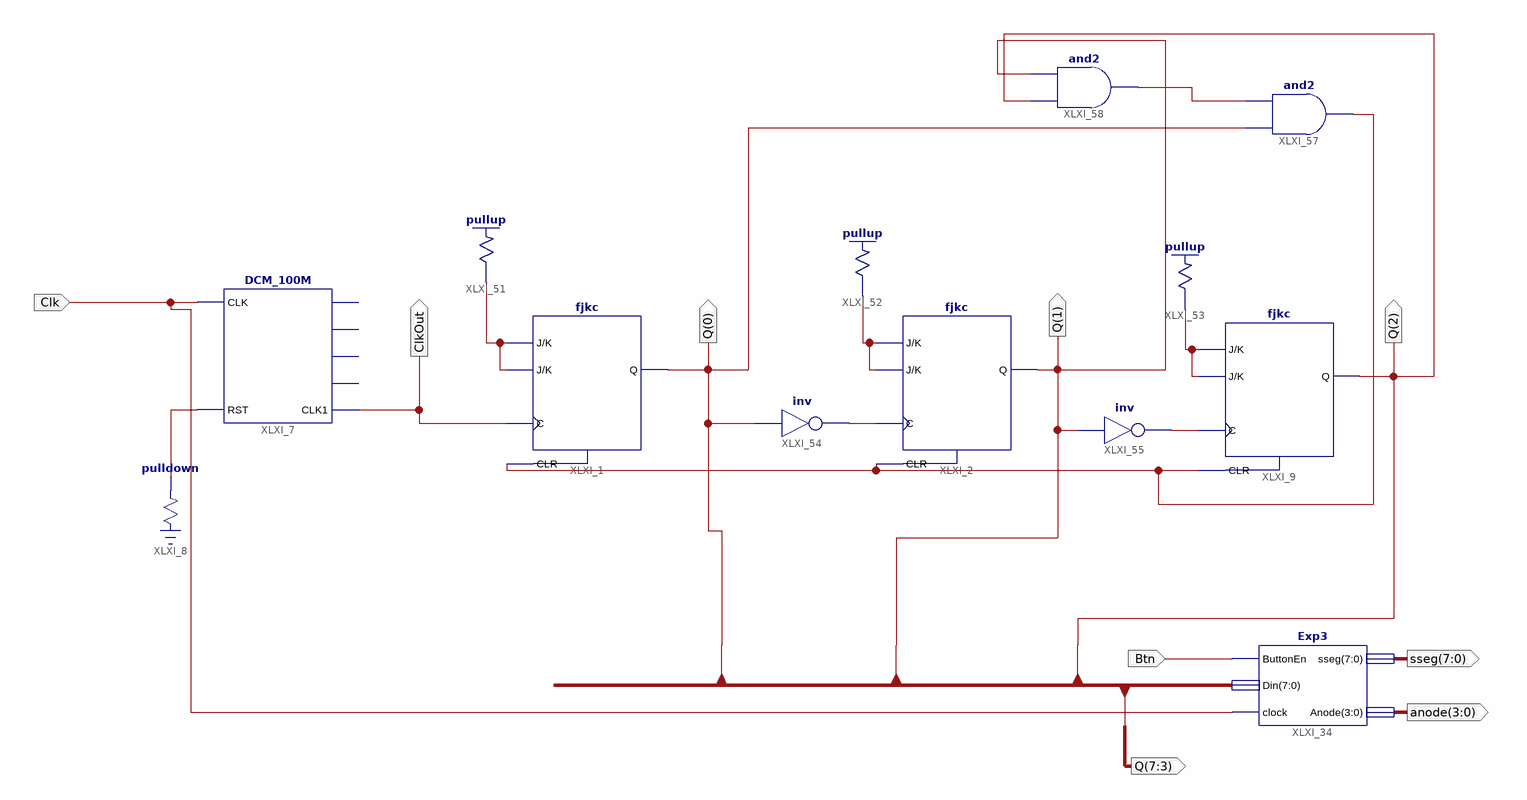
[diagram p0: schematic sheet 1]
// Xilinx ISE schematic Exp3ModCounter.sch (spartan3e) as structural Verilog: 13 symbols, 9 ports
module Exp3ModCounter (
  input  Clk,
  input  Btn,
  output [7:0] sseg,
  output [3:0] anode,
  output [7:0] Q,
  output ClkOut
);

  wire XLXN_10, XLXN_94, XLXN_95, XLXN_96, XLXN_97, XLXN_100, XLXN_104, XLXN_106;

  Exp3 XLXI_34 (.ButtonEn(Btn), .Din(Q), .clock(Clk), .sseg(sseg), .Anode(anode));
  fjkc XLXI_1 (.C(ClkOut), .CLR(XLXN_104), .J(XLXN_94), .K(XLXN_94), .Q(Q[0]));
  fjkc XLXI_2 (.C(XLXN_97), .CLR(XLXN_104), .J(XLXN_95), .K(XLXN_95), .Q(Q[1]));
  DCM_100M XLXI_7 (.CLK(Clk), .RST(XLXN_10), .CLK1(ClkOut));  // open: CLK1M, CLK10k, CLK1k, CLK100
  \pulldown  XLXI_8 (.O(XLXN_10));
  fjkc XLXI_9 (.C(XLXN_100), .CLR(XLXN_104), .J(XLXN_96), .K(XLXN_96), .Q(Q[2]));
  \pullup  XLXI_51 (.O(XLXN_94));
  \pullup  XLXI_52 (.O(XLXN_95));
  \pullup  XLXI_53 (.O(XLXN_96));
  not XLXI_54 (XLXN_97, Q[0]);
  not XLXI_55 (XLXN_100, Q[1]);
  and XLXI_57 (XLXN_104, Q[0], XLXN_106);
  and XLXI_58 (XLXN_106, Q[2], Q[1]);
endmodule
